# EAGLE design CouchProtato-PPG-MODULE (EAGLE 9.5.2)
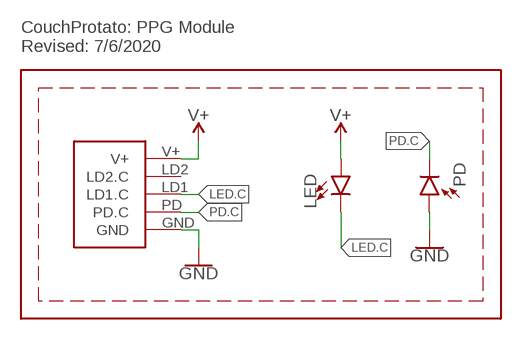
[diagram p0: schematic, sheet 1]

## Parts
LED  LED0805  [LED-0805]
PD  PHOTODIODE2-SMD.GULLWING  [2-SMD.GULLWING]
U$3  PPG.MODULE.2  [PPG.MODULE.2]

## Nets
GND: PD.+(A) U$3.GND
LED.C: LED.C U$3.LD1(LD1.C)
PD.C: PD.-(C) U$3.PD(PD.C)
V+: LED.A U$3.V+
Unconnected: U$3.LD2(LD2.C)

## Notes on the sheet
- CouchProtato: PPG Module
  Revised: 7/6/2020

## Library data of the parts
LED = LinnesLab-LED:LED: LED (Generic) Standard schematic elements and footprints for 5mm, 3mm, 1206, and 0603 sized LEDs. Generic LEDs with no color specified. LTST-C190KGKT: arrow indicates cathode
PD = LinnesLab-Sensors:PHOTODIODE
U$3 = LinnesLab-Connectors:PPG.MODULE.2: Digi-Key Part Number: S9014E-50-ND Manufacturer Part Number: GRPB501VWVN-RC Description: 1mm insulation height 0.05in pitch 50 positions

## Board
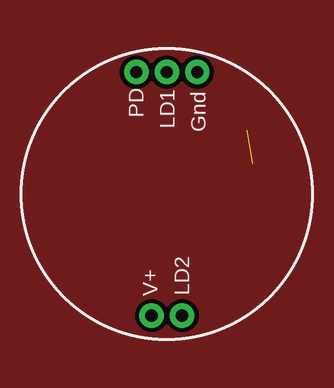
[diagram p1: board, top side]
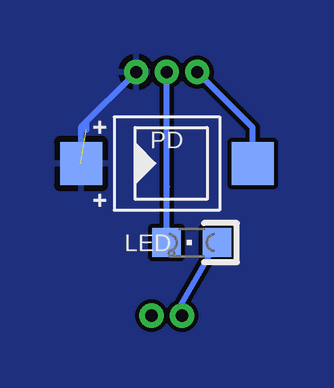
[diagram p2: board, bottom side, seen from below]

No outline drawn. Coordinates in mm, seen from the top.
Copper layers (1*16): Top 0.035mm / dielectric 1.5mm / Bottom 0.035mm
Design rules "default": minimum track width 6mil, minimum drill 0.35mm, track to track 6mil, track to pad 6mil, pad to pad 6mil, via to via 6mil, smd to smd 6mil, copper to edge 40mil, drill to drill 6mil, minimum pad ring 10mil, minimum via ring 8mil, stop-mask expansion 4mil, vias tented up to drill 0mil, thermal gap 10mil

### Footprints (pad centres in the part's own frame; a part is rotated, then mirrored left to right if it is on the bottom)
LED-0805 = smd 1.2 x 1.2: A 0,-1.05; C 0,1.05
2-SMD.GULLWING = smd 1.75 x 1.8: + -3.575,0; - 3.575,0
PPG.MODULE.2 = drill 0.508 pad 0.94: GND 1.27,5.08; LD1 0,5.08; LD2 0.635,-5.08; PD -1.27,5.08; V+ -0.635,-5.08

### Placement (x,y rotation side)
LED  17.96,16.97 90 bottom
PD  19,20.27 0 bottom
U$3  19,19 0 top

### Tracks (layer width: path | path; a pad name or v marks a point on that pad's centre or on a via)
3.3V
  pour Top (isolate 0.178): 38,38 0,38 0,0 38,0
GND  (1 unrouted)
  Bottom 0.254: 22.35,22 22.35,21.67 | U$3.GND 22.57,21.78 PD.+
  pour Bottom (isolate 0.178): 35.5,35.5 2.5,35.5 2.5,2.5 35.5,2.5
LED.C
  Bottom 0.254: LED.C 19,19.29 U$3.LD1
PD.C
  Bottom 0.254: PD.- 15.42,21.77 U$3.PD
V+
  Bottom 0.254: 18.47,14.02 U$3.V+ 18.55,14.11 LED.A